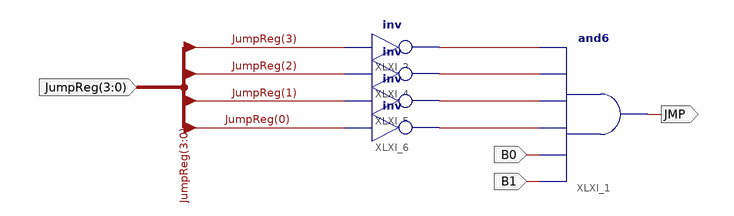
[diagram p0: schematic sheet 1]
// Xilinx ISE schematic Jump_Reg.sch (spartan3e) as structural Verilog: 5 symbols, 4 ports
module Jump_Reg (
  input  [3:0] JumpReg,
  input  B0,
  input  B1,
  output JMP
);

  wire XLXN_6, XLXN_7, XLXN_8, XLXN_9;

  and XLXI_1 (JMP, B1, B0, XLXN_9, XLXN_8, XLXN_7, XLXN_6);
  not XLXI_2 (XLXN_6, JumpReg[3]);
  not XLXI_4 (XLXN_7, JumpReg[2]);
  not XLXI_5 (XLXN_8, JumpReg[1]);
  not XLXI_6 (XLXN_9, JumpReg[0]);
endmodule
